# Altium project VESC_DEVICE.PrjPcb
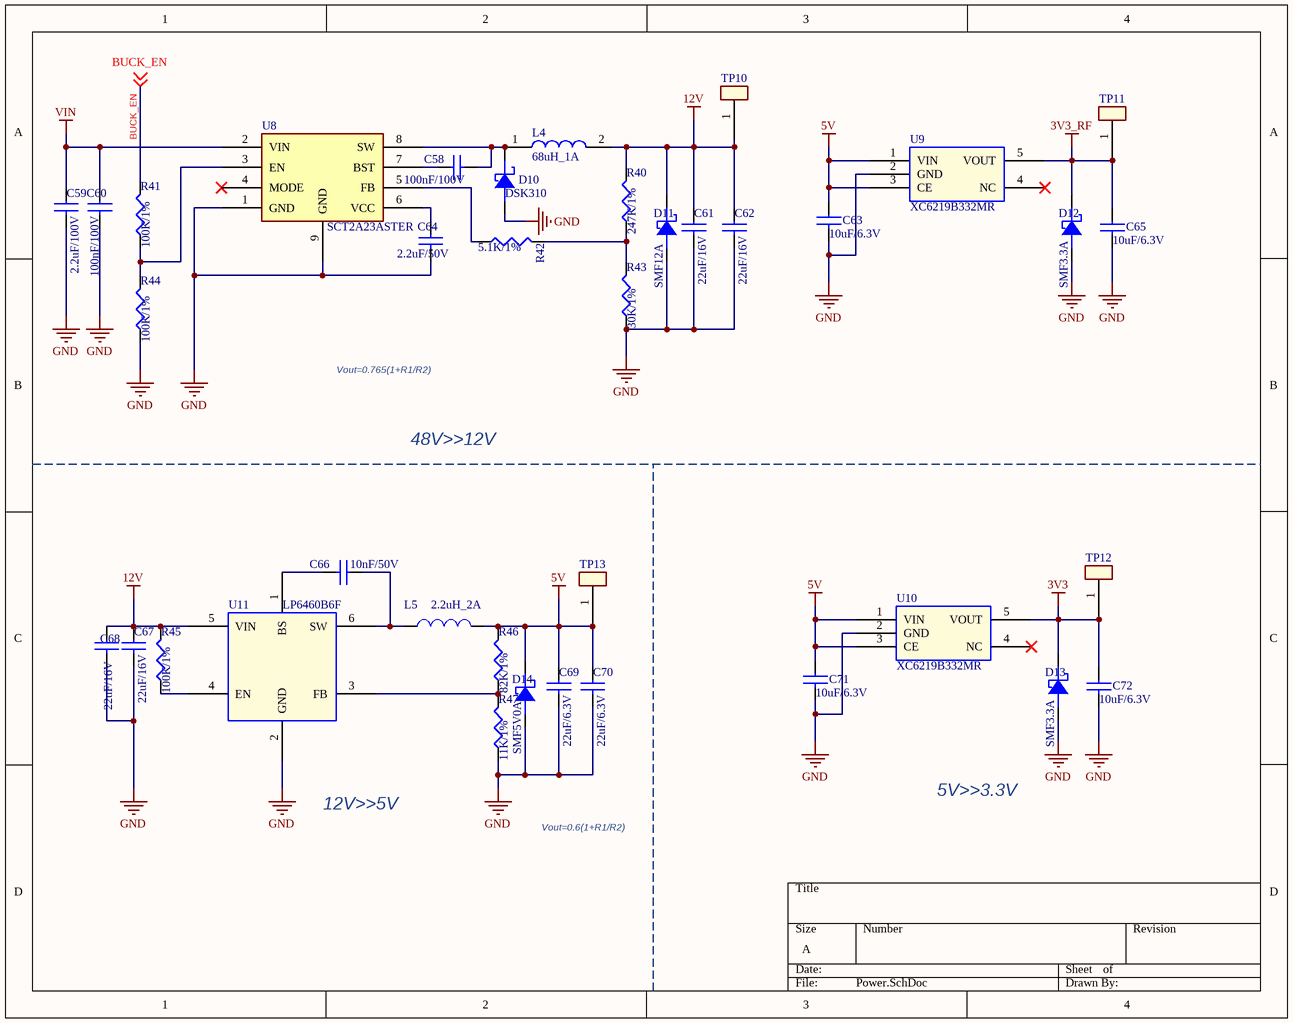
[diagram p0: Power.SchDoc]
5 sheets, 156 parts. Net scope: global (net labels, ports and power ports of the same name join across sheets).
Board file: VESC_DEVICE_60100.PcbDoc
Sheets:
  Power.SchDoc
  BMI160.SchDoc
  NRF51822.SchDoc
  Gate_Drive.SchDoc
  Connector.SchDoc

## Sheet Power.SchDoc
size A

### Parts
C58  100nF/100V  [C0603]
C59  2.2uF/100V  [C1206]
C60  100nF/100V  [C0603]
C61  22uF/16V  [C0805]
C62  22uF/16V  [C0805]
C63  10uF/6.3V  [C0402]
C64  2.2uF/50V  [C0603]
C65  10uF/6.3V  [C0402]
C66  10nF/50V  [C0402]
C67  22uF/16V  [C0805]
C68  22uF/16V  [C0805]
C69  22uF/6.3V  [C0805]
C70  22uF/6.3V  [C0805]
C71  10uF/6.3V  [C0402]
C72  10uF/6.3V  [C0402]
D10  DSK310  [SOD-123F]
D11  SMF12A  [SOD-123F]
D12  SMF3.3A  [SOD-123F]
D13  SMF3.3A  [SOD-123F]
D14  SMF5V0A  [SOD-123F]
L4  68uH_1A  [L5040]
L5  2.2uH_2A  [L4020]
R40  247K/1%  [R0402]
R41  100K/1%  [R0402]
R42  5.1K/1%  [R0402]
R43  30K/1%  [R0402]
R44  100K/1%  [R0402]
R45  100K/1%  [R0402]
R46  82K/1%  [R0402]
R47  11K/1%  [R0402]
TP10  TEST POINT  [test_point_100_smd]  (value not drawn)
TP11  TEST POINT  [test_point_100_smd]  (value not drawn)
TP12  TEST POINT  [test_point_100_smd]  (value not drawn)
TP13  TEST POINT  [test_point_100_smd]  (value not drawn)
U8  SCT2A23ASTER  [ESOP-8_L4.9-W3.9-P1.27-LS6.0-BL-EP]
U9  XC6219B332MR  [SOT-23-5]
U10  XC6219B332MR  [SOT-23-5]
U11  LP6460B6F  [SOT-23-6]

### Nets
3V3: C72.1 D13.1(K) TP12.1 U10.5(VOUT)
3V3_RF: C65.1 D12.1(K) TP11.1 U9.5(VOUT)
5V: C63.1 C69.1 C70.1 C71.1 D14.1(K) L5.2 R46.2 TP13.1 U9.1(VIN) U9.3(CE) U10.1(VIN) U10.3(CE)
12V: C61.1 C62.1 C67.1 C68.1 D11.1(K) L4.2 R40.2 R45.2 TP10.1 U11.5(VIN)
GND: C59.2 C60.2 C61.2 C62.2 C63.2 C64.2 C65.2 C67.2 C68.2 C69.2 C70.2 C71.2 C72.2 D10.2(A) D11.2(A) D12.2(A) D13.2(A) D14.2(A) R43.1 R44.1 R47.1 U8.1(GND) U8.9(GND) U9.2(GND) U10.2(GND) U11.2(GND)
VIN: C59.1 C60.1 U8.2(VIN)
BUCK_EN: R41.2 ; off-sheet BUCK_EN
NetC58_1: C58.1 U8.7(BST)
NetC58_2: C58.2 D10.1(K) L4.1 U8.8(SW)
NetC64_1: C64.1 U8.6(VCC)
NetC66_1: C66.1 L5.1 U11.6(SW)
NetC66_2: C66.2 U11.1(BS)
NetR40_1: R40.1 R42.2 R43.2
NetR41_1: R41.1 R44.2 U8.3(EN)
NetR42_1: R42.1 U8.5(FB)
NetR45_1: R45.1 U11.4(EN)
NetR46_1: R46.1 R47.2 U11.3(FB)

Not connected (* = marked no-connect by the designer): U8 4(MODE)*; U9 4(NC)*; U10 4(NC)*

### Notes on the sheet
- Vout=0.765(1+R1/R2)
- 48V>>12V
- 12V>>5V
- Vout=0.6(1+R1/R2)
- 5V>>3.3V

### Library data of the parts
C58-C72 = CAP NP
  C58 C60 C64: PCB Footprint: C0603
  C59: PCB Footprint: C1206
  C61 C62 C67-C70: PCB Footprint: C0805
  C63 C65 C66 C71 C72: PCB Footprint: C0402
D10-D14 = DIODE SCHOTTKY21: PCB Footprint: SOD-123F
L4 = 74404054221: Inductor; Manufacturer_Name: Wurth Elektronik; Datasheet Link: https://www.mouser.com/datasheet/2/445/74404054221-1280555.pdf; Height: 4mm; Manufacturer_Part_Number: 74404054221; Mouser Part Number: 710-74404054221; Mouser Price/Stock: https://www.mouser.co.uk/ProductDetail/Wurth-Elektronik/74404054221?qs=f9yNj16SXrLBSuRgk86STQ%3D%3D
L5 = INDUCTOR: PCB Footprint: L4020
R40-R47 = RESISTOR: PCB Footprint: R0402
U8 = SCT2A23ASTER: Manufacturer: SCT(芯洲科技); Add into BOM: yes; Function: 降压型; Input Voltage: 4.5V~100V; Output Current: 1.2A; Switching Frequency: 300kHz; Number of Outputs: 1; Switch tube (built-in/external): 内置; Symbol: SCT2A23ASTER; Device: SCT2A23ASTER; LCSC Part Name: 宽输入范围1.2A降压DC-DC转换器; Supplier Part: C2901894; Manufacturer Part: SCT2A23ASTER; Supplier Footprint: ESOP-8; Datasheet: https://atta.szlcsc.com/upload/public/pdf/source/20211013/6F4F933FB08DD1E1458E8CCC6D5C6936.pdf; Supplier: LCSC; Convert to PCB: yes; Operating Temperature: -40℃~+125℃@(TJ)
U9 U10 = XC6219B332MR: PCB Footprint: SOT-23-5
U11 = LP6460B6F: PCB Footprint: SOT-23-6

## Sheet BMI160.SchDoc
size A
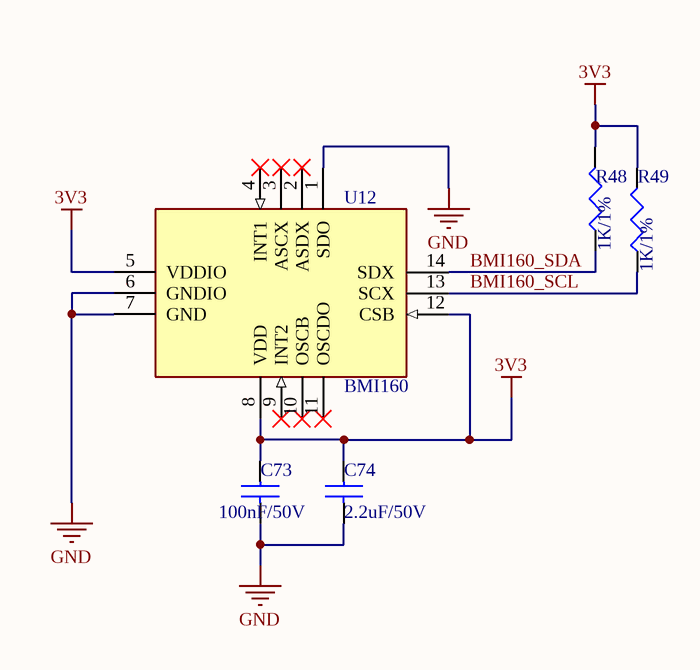
[diagram p1: BMI160.SchDoc]

### Parts
C73  100nF/50V  [C0402]
C74  2.2uF/50V  [C0402]
R48  1K/1%  [R0402]
R49  1K/1%  [R0402]
U12  BMI160  [PQFN50P300X250X88-14N]

### Nets
3V3: C73.1 C74.1 R48.2 R49.2 U12.5(VDDIO) U12.8(VDD) U12.12(CSB)
GND: C73.2 C74.2 U12.1(SDO) U12.6(GNDIO) U12.7(GND)
BMI160_SCL: R49.1 U12.13(SCX)
BMI160_SDA: R48.1 U12.14(SDX)

Not connected (* = marked no-connect by the designer): U12 2(ASDX)* 3(ASCX)* 4(INT1)* 9(INT2)* 10(OSCB)* 11(OSCDO)*

### Library data of the parts
C73 C74 = CAP NP: PCB Footprint: C0402
R48 R49 = RESISTOR: PCB Footprint: R0402
U12 = BMI160: Integrated Circuit; Manufacturer_Name: BOSCH; Datasheet Link: https://datasheet.datasheetarchive.com/originals/distributors/DKDS41/DSANUWW0031095.pdf; Height: 0.88mm; Manufacturer_Part_Number: BMI160; Mouser Part Number: 262-BMI160; Mouser Price/Stock: https://www.mouser.co.uk/ProductDetail/Bosch-Sensortec/BMI160?qs=Lj1LZLjqIN1DEsUDgjehlg%3D%3D; Arrow Part Number: BMI160; Arrow Price/Stock: https://www.arrow.com/en/products/bmi160/bosch?region=nac

## Sheet NRF51822.SchDoc
size A
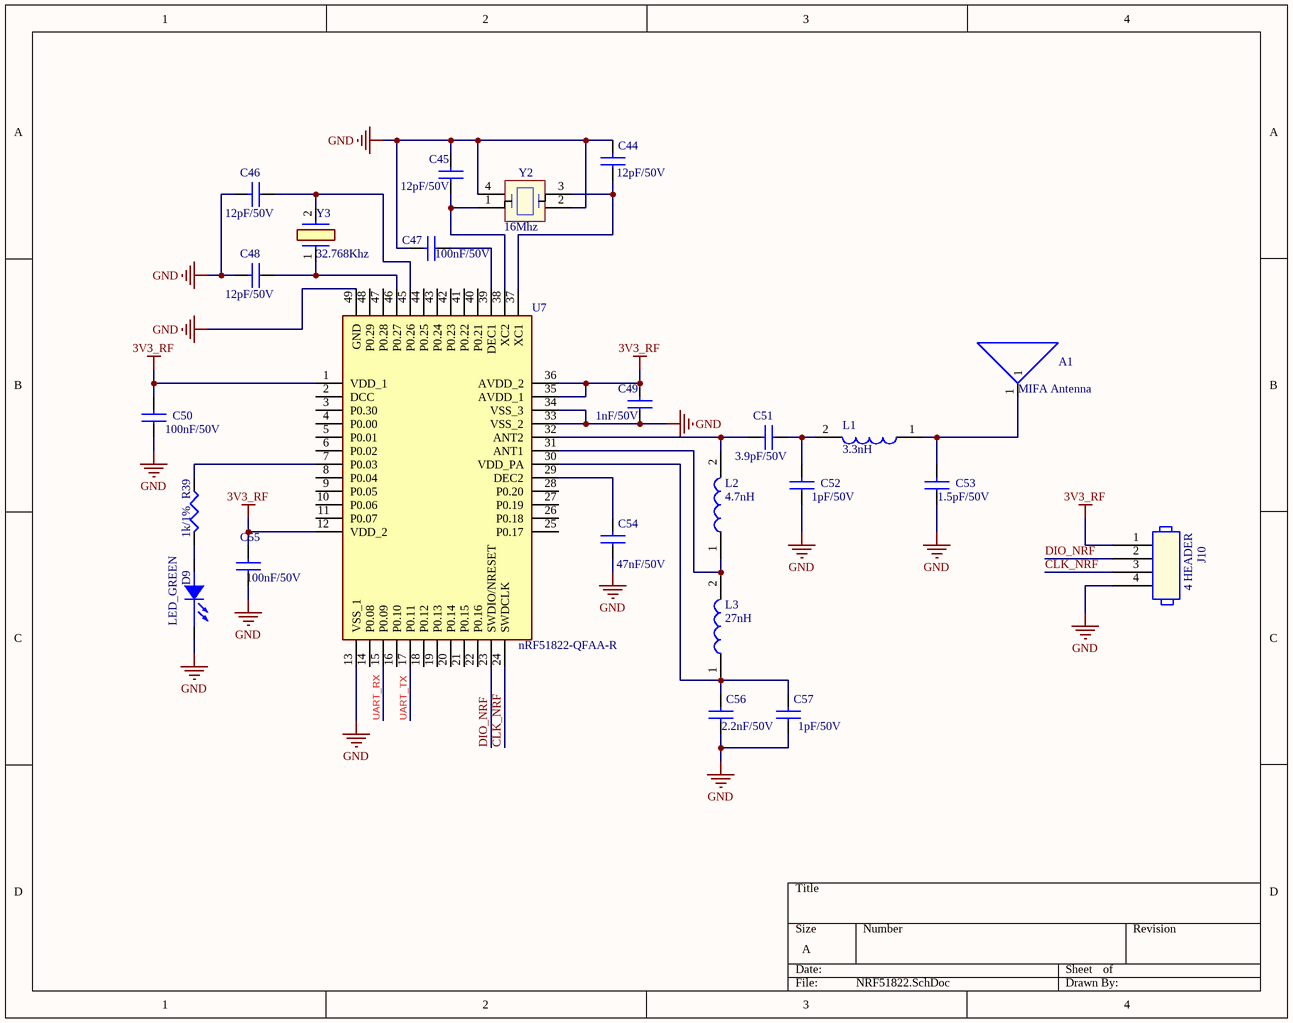
[diagram p2: NRF51822.SchDoc]

### Parts
A1  MIFA Antenna  [ANT-2.4GHZ-8.0X1.0MM]  (no BOM)
C44  12pF/50V  [C0402]
C45  12pF/50V  [C0402]
C46  12pF/50V  [C0402]
C47  100nF/50V  [C0402]
C48  12pF/50V  [C0402]
C49  1nF/50V  [C0402]
C50  100nF/50V  [C0402]
C51  3.9pF/50V  [C0402]
C52  1pF/50V  [C0402]
C53  1.5pF/50V  [C0402]
C54  47nF/50V  [C0402]
C55  100nF/50V  [C0402]
C56  2.2nF/50V  [C0402]
C57  1pF/50V  [C0402]
D9  LED_GREEN  [LED0603]
J10  4 HEADER  [ISP-4P-2_54]
L1  3.3nH  [LQG15WH0N7B02D]
L2  4.7nH  [LQG15WH0N7B02D]
L3  27nH  [LQG15WH0N7B02D]
R39  1k/1%  [R0402]
U7  nRF51822-QFAA-R  [QFN40P600X600X95-49N-D]
Y2  16Mhz  [Q22FA12800400]
Y3  32.768Khz  [ABS0532768KHZ9T]

### Nets
3V3_RF: C49.2 C50.2 C55.2 J10.1 U7.1(VDD_1) U7.12(VDD_2) U7.35(AVDD_1) U7.36(AVDD_2)
GND: C44.2 C45.2 C46.2 C47.2 C48.2 C49.1 C50.1 C52.1 C53.1 C54.1 C55.1 C56.1 C57.1 D9.1(CATHODE) J10.4 U7.13(VSS_1) U7.33(VSS_2) U7.34(VSS_3) U7.49(GND) Y2.2(GND_1) Y2.4(GND_2)
CLK_NRF: J10.3 U7.24(SWDCLK)
DIO_NRF: J10.2 U7.23(SWDIO/NRESET)
UART_RX: U7.15(P0.09)
UART_TX: U7.17(P0.11)
NetA1_1: A1.1 C53.2 L1.1
NetC44_1: C44.1 U7.37(XC1) Y2.3(CRYSTAL_2)
NetC45_1: C45.1 U7.38(XC2) Y2.1(CRYSTAL_1)
NetC46_1: C46.1 U7.45(P0.26) Y3.2
NetC47_1: C47.1 U7.39(DEC1)
NetC48_1: C48.1 U7.46(P0.27) Y3.1
NetC51_1: C51.1 C52.2 L1.2
NetC51_2: C51.2 L2.2 U7.32(ANT2)
NetC54_2: C54.2 U7.29(DEC2)
NetC56_2: C56.2 C57.2 L3.1 U7.30(VDD_PA)
NetD9_2: D9.2(ANODE) R39.1
NetL2_1: L2.1 L3.2 U7.31(ANT1)
NetR39_2: R39.2 U7.7(P0.03)

Not connected (* = marked no-connect by the designer): U7 2(DCC) 3(P0.30) 4(P0.00) 5(P0.01) 6(P0.02) 8(P0.04) 9(P0.05) 10(P0.06) 11(P0.07) 14(P0.08) 16(P0.10) 18(P0.12) 19(P0.13) 20(P0.14) 21(P0.15) 22(P0.16) 25(P0.17) 26(P0.18) 27(P0.19) 28(P0.20) 40(P0.21) 41(P0.22) 42(P0.23) 43(P0.24) 44(P0.25) 47(P0.28) 48(P0.29)

### Library data of the parts
A1 = Ceramic _ANTENNA: None; AMBIQ PN: PCB_ANTENNA
C44-C57 = CAP NP: PCB Footprint: C0402
D9 = LED: PCB Footprint: LED0603
L1-L3 = LQG15HS4N7C02D: Inductor; Manufacturer_Name: Murata Electronics; Datasheet Link: https://search.murata.co.jp/Ceramy/image/img/P02/JELF243B-0010.pdf; Height: 0.6mm; Manufacturer_Part_Number: LQG15HS4N7C02D; Mouser Part Number: 81-LQG15HS4N7C02D; Mouser Price/Stock: https://www.mouser.co.uk/ProductDetail/Murata-Electronics/LQG15HS4N7C02D?qs=60uY6ySkanQsgm4t8ngjFA%3D%3D; Arrow Part Number: LQG15HS4N7C02D; Arrow Price/Stock: https://www.arrow.com/en/products/lqg15hs4n7c02d/murata-manufacturing
R39 = RESISTOR: PCB Footprint: R0402
U7 = nRF51822-QFAA-R: Integrated Circuit; Manufacturer_Name: Nordic Semiconductor; Datasheet Link: https://datasheet.datasheetarchive.com/originals/distributors/Datasheets-DGA5/435665.pdf; Height: 0.95mm; Manufacturer_Part_Number: nRF51822-QFAA-R; Mouser Part Number: 949-NRF51822-QFAA-R; Mouser Price/Stock: https://www.mouser.co.uk/ProductDetail/Nordic-Semiconductor/nRF51822-QFAA-R?qs=7xCC5jQa1OJP%2FZdtChopZw%3D%3D; Arrow Part Number: NRF51822-QFAA-R; Arrow Price/Stock: https://www.arrow.com/en/products/nrf51822-qfaa-r/nordic-semiconductor?utm_currency=USD&region=nac
Y2 = Q22FA12800400: Crystal or Oscillator; Manufacturer_Name: Seiko Epson Corporation; Datasheet Link: https://datasheet.lcsc.com/szlcsc/Seiko-Epson-Q22FA12800400_C255875.pdf; Height: 0.5mm; Manufacturer_Part_Number: Q22FA12800400
Y3 = ABS05-32.768KHZ-9-T: Crystal or Oscillator; Manufacturer_Name: ABRACON; Datasheet Link: https://abracon.com/Resonators/ABS05.pdf; Height: 0.5mm; Manufacturer_Part_Number: ABS05-32.768KHZ-9-T; Mouser Part Number: 815-ABS05-32.768K9T; Mouser Price/Stock: https://www.mouser.co.uk/ProductDetail/ABRACON/ABS05-32.768KHZ-9-T?qs=Pyu0ZBy%2FIJbsNYnIET1z3A%3D%3D; Arrow Part Number: ABS05-32.768KHZ-9-T; Arrow Price/Stock: https://www.arrow.com/en/products/abs05-32.768khz-9-t/abracon?region=nac
J10 = 4 HEADER: PCB Footprint: ISP-4P-2_54

## Sheet Gate_Drive.SchDoc
size A4
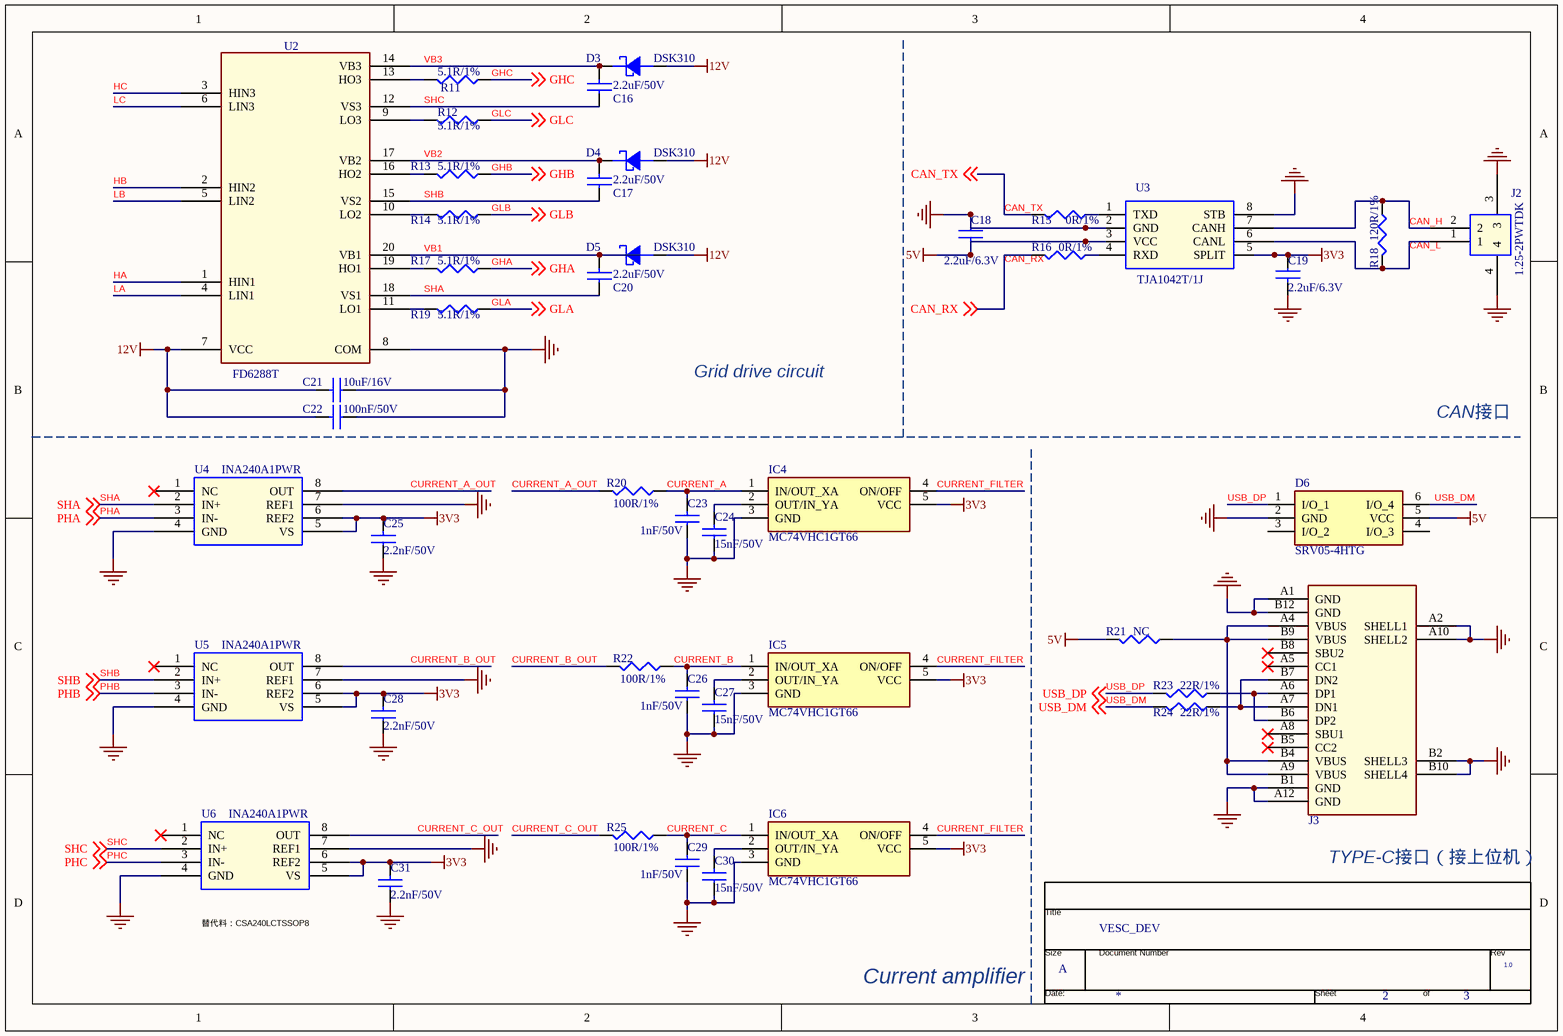
[diagram p3: Gate_Drive.SchDoc]

### Parts
(Parts that share a designator on the sheet are numbered #1, #2 ... from top to bottom, then left to right.)
*#1  Page Count: 3  Page Number: 2  Page Size: A  Title: VESC_DEV  RevCode: 1.0  (hidden comment: TitleBlock0)  (graphical)
C16  2.2uF/50V  [C0603]
C17  2.2uF/50V  [C0603]
C18  2.2uF/6.3V  [C0402]
C19  2.2uF/6.3V  [C0402]
C20  2.2uF/50V  [C0603]
C21  10uF/16V  [C0603]
C22  100nF/50V  [C0402]
C23  1nF/50V  [C0402]
C24  15nF/50V  [C0402]
C25  2.2nF/50V  [C0402]
C26  1nF/50V  [C0402]
C27  15nF/50V  [C0402]
C28  2.2nF/50V  [C0402]
C29  1nF/50V  [C0402]
C30  15nF/50V  [C0402]
C31  2.2nF/50V  [C0402]
D3  DSK310  [SOD-123F]
D4  DSK310  [SOD-123F]
D5  DSK310  [SOD-123F]
D6  SRV05-4HTG  [SOT95P280X145-6N]
IC4  MC74VHC1GT66  [SOT95P275X110-5N]
IC5  MC74VHC1GT66  [SOT95P275X110-5N]
IC6  MC74VHC1GT66  [SOT95P275X110-5N]
J2  1.25-2PWTDK  [SMD-2P-1_25]
J3  TYPE-C 16PLC-H10.0  [TYPE-C-TH_16PLC-H10.0]  (value not drawn)
R11  5.1R/1%  [R0603]
R12  5.1R/1%  [R0603]
R13  5.1R/1%  [R0603]
R14  5.1R/1%  [R0603]
R15  0R/1%  [R0402]
R16  0R/1%  [R0402]
R17  5.1R/1%  [R0603]
R18  120R/1%  [R0402]
R19  5.1R/1%  [R0603]
R20  100R/1%  [R0402]
R21  NC  [R0603]
R22  100R/1%  [R0402]
R23  22R/1%  [R0402]
R24  22R/1%  [R0402]
R25  100R/1%  [R0402]
U2  FD6288T  [TSSOP-20]
U3  TJA1042T/1J  [SOP-8]
U4  INA240A1PWR  [TSSOP-8]
U5  INA240A1PWR  [TSSOP-8]
U6  INA240A1PWR  [TSSOP-8]

### Nets
3V3: C19.1 C25.2 C28.2 C31.2 IC4.5(VCC) IC5.5(VCC) IC6.5(VCC) U3.5(SPLIT) U4.5(VS) U4.6(REF2) U5.5(VS) U5.6(REF2) U6.5(VS) U6.6(REF2)
5V: C18.2 D6.5(VCC) R21.2 U3.3(VCC)
12V: C21.2 C22.2 D3.2(A) D4.2(A) D5.2(A) U2.7(VCC)
GND: C18.1 C19.2 C21.1 C22.1 C23.1 C24.1 C25.1 C26.1 C27.1 C28.1 C29.1 C30.1 C31.1 D6.2(GND) IC4.3(GND) IC5.3(GND) IC6.3(GND) J2.3 J2.4 J3.A1(GND) J3.A2(SHELL1) J3.A10(SHELL2) J3.A12(GND) J3.B1(GND) J3.B2(SHELL3) J3.B10(SHELL4) J3.B12(GND) U2.8(COM) U3.2(GND) U3.8(STB) U4.4(GND) U4.7(REF1) U5.4(GND) U5.7(REF1) U6.4(GND) U6.7(REF1)
CAN_H: J2.2 R18.1 U3.7(CANH)
CAN_L: J2.1 R18.2 U3.6(CANL)
CAN_RX: R16.2 ; off-sheet CAN_RX
CAN_TX: R15.2 ; off-sheet CAN_TX
CURRENT_A: C23.2 IC4.1(IN/OUT_XA) R20.1
CURRENT_A_OUT: R20.2 U4.8(OUT)
CURRENT_B: C26.2 IC5.1(IN/OUT_XA) R22.1
CURRENT_B_OUT: R22.2 U5.8(OUT)
CURRENT_C: C29.2 IC6.1(IN/OUT_XA) R25.1
CURRENT_C_OUT: R25.2 U6.8(OUT)
CURRENT_FILTER: IC4.4(ON/OFF) IC5.4(ON/OFF) IC6.4(ON/OFF)
GHA: R17.1 ; off-sheet GHA
GHB: R13.1 ; off-sheet GHB
GHC: R11.1 ; off-sheet GHC
GLA: R19.1 ; off-sheet GLA
GLB: R14.1 ; off-sheet GLB
GLC: R12.1 ; off-sheet GLC
HA: U2.1(HIN1)
HB: U2.2(HIN2)
HC: U2.3(HIN3)
LA: U2.4(LIN1)
LB: U2.5(LIN2)
LC: U2.6(LIN3)
PHA: U4.3(IN-) ; off-sheet PHA
PHB: U5.3(IN-) ; off-sheet PHB
PHC: U6.3(IN-) ; off-sheet PHC
SHA: C20.1 U2.18(VS1) U4.2(IN+) ; off-sheet SHA
SHB: C17.1 U2.15(VS2) U5.2(IN+) ; off-sheet SHB
SHC: C16.1 U2.12(VS3) U6.2(IN+) ; off-sheet SHC
USB_DM: D6.6(I/O_4) R24.2 ; off-sheet USB_DM
USB_DP: D6.1(I/O_1) R23.2 ; off-sheet USB_DP
VB1: C20.2 D5.1(K) U2.20(VB1)
VB2: C17.2 D4.1(K) U2.17(VB2)
VB3: C16.2 D3.1(K) U2.14(VB3)
NetC24_2: C24.2 IC4.2(OUT/IN_YA)
NetC27_2: C27.2 IC5.2(OUT/IN_YA)
NetC30_2: C30.2 IC6.2(OUT/IN_YA)
NetJ3_A4: J3.A4(VBUS) J3.A9(VBUS) J3.B4(VBUS) J3.B9(VBUS) R21.1
NetJ3_A6: J3.A6(DP1) J3.B6(DP2) R23.1
NetJ3_A7: J3.A7(DN1) J3.B7(DN2) R24.1
NetR11_2: R11.2 U2.13(HO3)
NetR12_2: R12.2 U2.9(LO3)
NetR13_2: R13.2 U2.16(HO2)
NetR14_2: R14.2 U2.10(LO2)
NetR15_1: R15.1 U3.1(TXD)
NetR16_1: R16.1 U3.4(RXD)
NetR17_2: R17.2 U2.19(HO1)
NetR19_2: R19.2 U2.11(LO1)

Not connected (* = marked no-connect by the designer): D6 3(I/O_2) 4(I/O_3); J3 A5(CC1)* A8(SBU1)* B5(CC2)* B8(SBU2)*; U4 1(NC)*; U5 1(NC)*; U6 1(NC)*

### Notes on the sheet
- Grid drive circuit
- CAN接口
- (near U6) 替代料：CSA240LCTSSOP8
- (near J3) TYPE-C接口（接上位机）
- Current amplifier
- (in symbol TitleBlock0) Title; Size; Document Number; Rev; Date:; Sheet; of

### Library data of the parts
C16-C31 = CAP NP
  C16 C17 C20 C21: PCB Footprint: C0603
  C18 C19 C22-C31: PCB Footprint: C0402
D3-D5 = DIODE SCHOTTKY21: PCB Footprint: SOD-123F
D6 = SRV05-4HTG: TVS Diode (Uni-directional); Manufacturer_Name: LITTELFUSE; Datasheet Link: https://componentsearchengine.com/Datasheets/2/SRV05-4HTG.pdf; Height: 1.45mm; Manufacturer_Part_Number: SRV05-4HTG; Mouser Part Number: 576-SRV05-4HTG; Mouser Price/Stock: https://www.mouser.co.uk/ProductDetail/Littelfuse/SRV05-4HTG?qs=TI15CVqcli3Liexbf3C%2FVA%3D%3D; Arrow Part Number: SRV05-4HTG; Arrow Price/Stock: https://www.arrow.com/en/products/srv05-4htg/littelfuse?region=nac
IC4-IC6 = MC74VHC1GT66: Integrated Circuit; Manufacturer_Name: onsemi; Datasheet Link: https://pdf1.alldatasheet.com/datasheet-pdf/view/148919/ETL/MC74VHC1GT66.html; Height: 1.1mm; Manufacturer_Part_Number: MC74VHC1GT66; Mouser Part Number: N/A; Mouser Price/Stock: https://www.mouser.co.uk/ProductDetail/onsemi/MC74VHC1GT66?qs=YA77FY0Msbu77w80Y0DYXA%3D%3D
J3 = TYPE-C 16PLC-H10.0: 连接器类型:Type-C;标准:USB 3.1;公母:母;安装方式:直插;触点数量:16P;端口数量:1;额定电流 - 电源:5A;触头材质:-;触头镀层:-;工作温度范围:-40℃~+85℃;; Manufacturer: SHOU HAN(首韩); Add into BOM: yes; Gender: 母; Number of Contacts: 16P; Number of Ports: 1; Current Rating - Power (Max): 5A; Rated Voltage (Max): 20V; Connect-Disconnect Life: 1万次; Core Colour: 黑色; Symbol: TYPE-C 16PLC-H10.0; Device: TYPE-C 16PLC-H10.0; LCSC Part Name: Type-C 母 直插; Supplier Part: C3151747; Manufacturer Part: TYPE-C 16PLC-H10.0; Supplier Footprint: 插件; Datasheet: https://atta.szlcsc.com/upload/public/pdf/source/20240529/CC9428849977884A813B584EA396EFE9.pdf; Supplier: LCSC; Convert to PCB: yes; Connector Type: Type-C; Standard: USB 3.1; Mounting Style: 直插; Contact Material: -; Contact Plating: -; Operating Temperature Range: -40℃~+85℃
R11-R14 R17 R19 = RESISTOR: PCB Footprint: R0402
R15 R16 R18 R20-R25 = RESISTOR
  R15 R16 R18 R20 R22-R25: PCB Footprint: R0402
  R21: PCB Footprint: R0603
*#1 = TitleBlock0: Page Create Date: March  8, 1995; Page Modify Date: *
J2 = 1.25-2PWTDK: PCB Footprint: SMD-2P-1_25
U3 = TJA1042T/1J: PCB Footprint: SOP-8
U4-U6 = INA240A1PWR: PCB Footprint: TSSOP-8

## Sheet Connector.SchDoc
size 246 x 182 mm
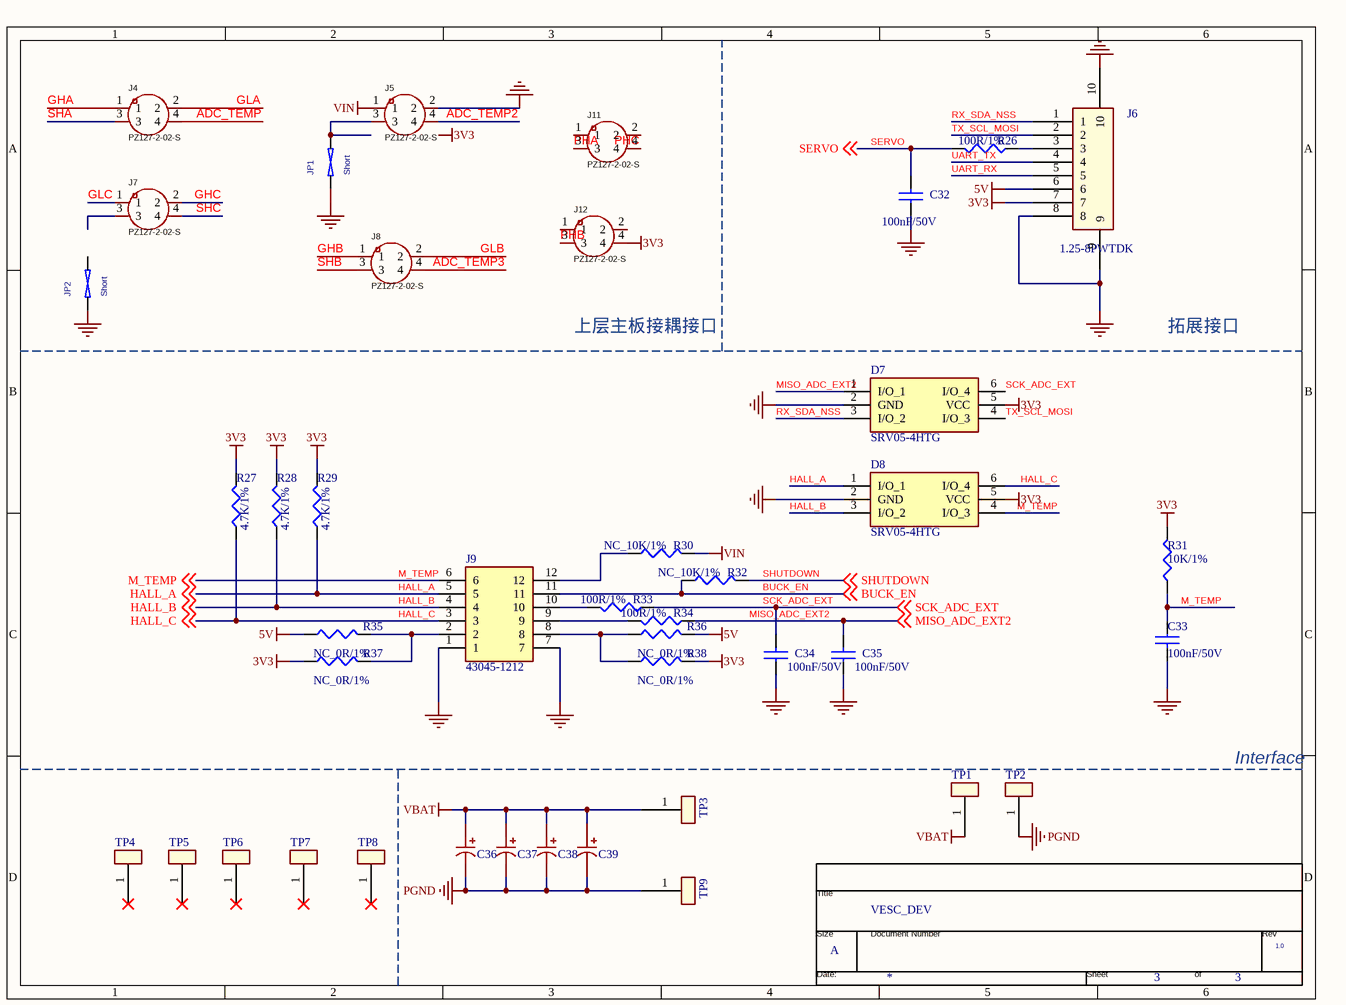
[diagram p4: Connector.SchDoc]

### Parts
(Parts that share a designator on the sheet are numbered #1, #2 ... from top to bottom, then left to right.)
*#2  Page Count: 3  Page Size: A  Title: VESC_DEV  RevCode: 1.0  (hidden comment: TitleBlock0)  (graphical)
C32  100nF/50V  [C0402]
C33  100nF/50V  [C0402]
C34  100nF/50V  [C0402]
C35  100nF/50V  [C0402]
C36  680uF  [CAP-TH_BD10.0-P5.00-D0.6-FD]  (value not drawn)
C37  680uF  [CAP-TH_BD10.0-P5.00-D0.6-FD]  (value not drawn)
C38  680uF  [CAP-TH_BD10.0-P5.00-D0.6-FD]  (value not drawn)
C39  680uF  [CAP-TH_BD10.0-P5.00-D0.6-FD]  (value not drawn)
D7  SRV05-4HTG  [SOT95P280X145-6N]
D8  SRV05-4HTG  [SOT95P280X145-6N]
J4  PZ127-2-02-S  [HDR-SMD_4P-P1.27-V-M-R2-C2-LS5.3]
J5  PZ127-2-02-S  [HDR-SMD_4P-P1.27-V-M-R2-C2-LS5.3]
J6  1.25-8PWTDK  [SMD-8P-1_25]
J7  PZ127-2-02-S  [HDR-SMD_4P-P1.27-V-M-R2-C2-LS5.3]
J8  PZ127-2-02-S  [HDR-SMD_4P-P1.27-V-M-R2-C2-LS5.3]
J9  43045-1212  [43045-12YY_121314]
J11  PZ127-2-02-S  [HDR-SMD_4P-P1.27-V-M-R2-C2-LS5.3]
J12  PZ127-2-02-S  [HDR-SMD_4P-P1.27-V-M-R2-C2-LS5.3]
JP1  Short  [SHORT]
JP2  Short  [SHORT]
R26  100R/1%  [R0402]
R27  4.7K/1%  [R0402]
R28  4.7K/1%  [R0402]
R29  4.7K/1%  [R0402]
R30  NC_10K/1%  [R0402]
R31  10K/1%  [R0402]
R32  NC_10K/1%  [R0402]
R33  100R/1%  [R0402]
R34  100R/1%  [R0402]
R35  NC_0R/1%  [R0402]
R36  NC_0R/1%  [R0402]
R37  NC_0R/1%  [R0402]
R38  NC_0R/1%  [R0402]
TP1  TEST POINT  [HOLE-4MM_M]  (value not drawn)
TP2  TEST POINT  [HOLE-4MM_M]  (value not drawn)
TP3  TEST POINT  [HOLE-8MM_M]  (value not drawn)
TP4  TEST POINT  [HOLE-4MM_M]  (value not drawn)
TP5  TEST POINT  [HOLE-4MM_M]  (value not drawn)
TP6  TEST POINT  [HOLE-8MM_M]  (value not drawn)
TP7  TEST POINT  [HOLE-8MM_M]  (value not drawn)
TP8  TEST POINT  [HOLE-8MM_M]  (value not drawn)
TP9  TEST POINT  [HOLE-8MM_M]  (value not drawn)

### Nets
3V3: D7.5(VCC) D8.5(VCC) J6.7 J12.4 R27.2 R28.2 R29.2 R31.2 R37.2 R38.1
5V: J6.6 R35.2 R36.1
GND: C32.1 C33.2 C34.1 C35.1 D7.2(GND) D8.2(GND) J5.2 J6.8 J6.9 J6.10 J9.1 J9.7 JP1.1 JP2.1
PGND: C36.2 C37.2 C38.2 C39.2 TP2.1 TP9.1
VBAT: C36.1 C37.1 C38.1 C39.1 TP1.1 TP3.1
VIN: J5.1 R30.1
ADC_TEMP: J4.4
ADC_TEMP2: J5.4
ADC_TEMP3: J8.4
BUCK_EN: J9.11 R32.2 ; off-sheet BUCK_EN
GHA: J4.1
GHB: J8.1
GHC: J7.2
GLA: J4.2
GLB: J8.2
GLC: J7.1
HALL_A: D8.1(I/O_1) J9.5 R29.1 ; off-sheet HALL_A
HALL_B: D8.3(I/O_2) J9.4 R28.1 ; off-sheet HALL_B
HALL_C: D8.6(I/O_4) J9.3 R27.1 ; off-sheet HALL_C
M_TEMP: C33.1 D8.4(I/O_3) J9.6 R31.1 ; off-sheet M_TEMP
MISO_ADC_EXT2: C35.2 D7.1(I/O_1) R34.2 ; off-sheet MISO_ADC_EXT2
PHA: J11.3
PHB: J12.3
PHC: J11.4
RX_SDA_NSS: D7.3(I/O_2) J6.1
SCK_ADC_EXT: C34.2 D7.6(I/O_4) R33.2 ; off-sheet SCK_ADC_EXT
SERVO: C32.2 R26.1 ; off-sheet SERVO
SHA: J4.3
SHB: J8.3
SHC: J7.4
SHUTDOWN: R32.1 ; off-sheet SHUTDOWN
TX_SCL_MOSI: D7.4(I/O_3) J6.2
UART_RX: J6.5
UART_TX: J6.4
NetJ5_3: J5.3 JP1.2
NetJ6_3: J6.3 R26.2
NetJ9_2: J9.2 R35.1 R37.1
NetJ9_8: J9.8 R36.2 R38.2
NetJ9_9: J9.9 R34.1
NetJ9_10: J9.10 R33.1
NetJ9_12: J9.12 R30.2

Not connected (* = marked no-connect by the designer): J7 3; J11 1 2; J12 1 2; JP2 2; TP4 1*; TP5 1*; TP6 1*; TP7 1*; TP8 1*

### Notes on the sheet
- 上层主板接耦接口
- 拓展接口
- Interface
- Labels drawn without touching a wire or pin: 3V3
- (in symbol TitleBlock0) Title; Size; Document Number; Rev; Date:; Sheet; of

### Library data of the parts
C32-C35 = CAP NP: PCB Footprint: C0402
C36-C39 = ERS1VM681G16OT: 容值:680uF;精度:±20%;额定电压:35V;纹波电流:-;等效串联电阻:-;; Manufacturer: AISHI(艾华集团); Add into BOM: yes; Tolerance: ±20%; Rated Voltage: 35V; Symbol: ERS1VM681G16OT; Device: ERS1VM681G16OT; LCSC Part Name: 680uF ±20% 35V; Supplier Part: C721283; Manufacturer Part: ERS1VM681G16OT; Supplier Footprint: 插件,D10xL16mm; Datasheet: https://atta.szlcsc.com/upload/public/pdf/source/20191015/C438940_4B8E60A742BB0AE40DDEF87A5C89089D.pdf; Supplier: LCSC; Convert to PCB: yes; Value: 680uF; Ripple Current: -; Equivalent Series Resistance(ESR): -; Lead Spacing: -; φD: -; L: -; Lifetime @ Temp: -
D7 D8 = SRV05-4HTG: as D6 on sheet Gate_Drive; Datasheet Link: https://componentsearchengine.com/Datasheets/2/SRV05-4HTG.pdf; Height: 1.45mm; Manufacturer_Part_Number: SRV05-4HTG; Mouser Part Number: 576-SRV05-4HTG; Mouser Price/Stock: https://www.mouser.co.uk/ProductDetail/Littelfuse/SRV05-4HTG?qs=TI15CVqcli3Liexbf3C%2FVA%3D%3D; Arrow Part Number: SRV05-4HTG; Arrow Price/Stock: https://www.arrow.com/en/products/srv05-4htg/littelfuse?region=nac
J4 J5 J7 J8 J11 J12 = PZ127-2-02-S: Manufacturer: HCTL(华灿天禄); Add into BOM: yes; Pin Structure: 2x2P; Pitch: 1.27mm; Circluar Pins/Square Pins: 方针; Current Rating (Max): 1A; Soldering Temperature(Max): 260℃@10S; Symbol: PZ127-2-02-S; Device: PZ127-2-02-S; LCSC Part Name: 2x2P 间距:1.27mm 方针 立贴; Supplier Part: C3975185; Manufacturer Part: PZ127-2-02-S; Supplier Footprint: SMD,P=1.27mm; JLCPCB Part Class: Extended Part; Datasheet: https://atta.szlcsc.com/upload/public/pdf/source/20230609/2ACB07ADC7D4DAF6D292F3D23C037F6C.pdf; Supplier: LCSC; Convert to PCB: yes; Row Spacing: 1.27mm; Mounting Type: 立贴; Number of Rows: 双排; Number of Pins: 4P; Length of Mating Pin: 4mm; Insulation Height: 1.5mm; Length of End Connection Pin: -; Contact Material: 黄铜; Operating Temperature Range: -40℃~+105℃; Color: 黑色
J9 = 43045-1212: Connector; Manufacturer_Name: Molex; Datasheet Link: https://www.molex.com/pdm_docs/sd/430450612_sd.pdf; Height: 9.91mm; Manufacturer_Part_Number: 43045-1212; Mouser Part Number: 538-43045-1212; Mouser Price/Stock: https://www.mouser.co.uk/ProductDetail/Molex/43045-1212?qs=359VwiUTsp27ERpkj8aHfQ%3D%3D
JP1 JP2 = SHORT: 2 PIN SHORTED TO CONNECT DIFFERENT NETS; PART_NUMBER: TMP-442; CLASS: DISCRETE
R26-R38 = RESISTOR: PCB Footprint: R0402
*#2 = TitleBlock0: Page Number: 3; Page Create Date: March  8, 1995; Page Modify Date: *

## Nets that join several sheets
3V3: Power (C72.1 D13.1 TP12.1 U10.5), BMI160 (7 pins), Gate_Drive (14 pins), Connector (10 pins)
3V3_RF: Power (C65.1 D12.1 TP11.1 U9.5), NRF51822 (8 pins)
5V: Power (12 pins), Gate_Drive (C18.2 D6.5 R21.2 U3.3), Connector (J6.6 R35.2 R36.1)
12V: Power (10 pins), Gate_Drive (6 pins)
GND: Power (26 pins), BMI160 (5 pins), NRF51822 (21 pins), Gate_Drive (36 pins), Connector (14 pins)
VIN: Power (C59.1 C60.1 U8.2), Connector (J5.1 R30.1)
BUCK_EN: Power (R41.2), Connector (J9.11 R32.2)
GHA: Gate_Drive (R17.1), Connector (J4.1)
GHB: Gate_Drive (R13.1), Connector (J8.1)
GHC: Gate_Drive (R11.1), Connector (J7.2)
GLA: Gate_Drive (R19.1), Connector (J4.2)
GLB: Gate_Drive (R14.1), Connector (J8.2)
GLC: Gate_Drive (R12.1), Connector (J7.1)
PHA: Gate_Drive (U4.3), Connector (J11.3)
PHB: Gate_Drive (U5.3), Connector (J12.3)
PHC: Gate_Drive (U6.3), Connector (J11.4)
SHA: Gate_Drive (C20.1 U2.18 U4.2), Connector (J4.3)
SHB: Gate_Drive (C17.1 U2.15 U5.2), Connector (J8.3)
SHC: Gate_Drive (C16.1 U2.12 U6.2), Connector (J7.4)
UART_RX: NRF51822 (U7.15), Connector (J6.5)
UART_TX: NRF51822 (U7.17), Connector (J6.4)